# Altium schematic sheet Mechanical.SchDoc: Mechanical
size A4; Organization: ORGANIZATION; Address1: ADDRESS 1; Address2: ADDRESS 2; Address3: ADDRESS 3; Address4: ADDRESS 4; Revision: -; SheetNumber: 11; SheetTotal: 11; ENG_APP_DATE: --/--/--; DSN_APP_DATE: --/--/--; CHK_APP_DATE: --/--/--
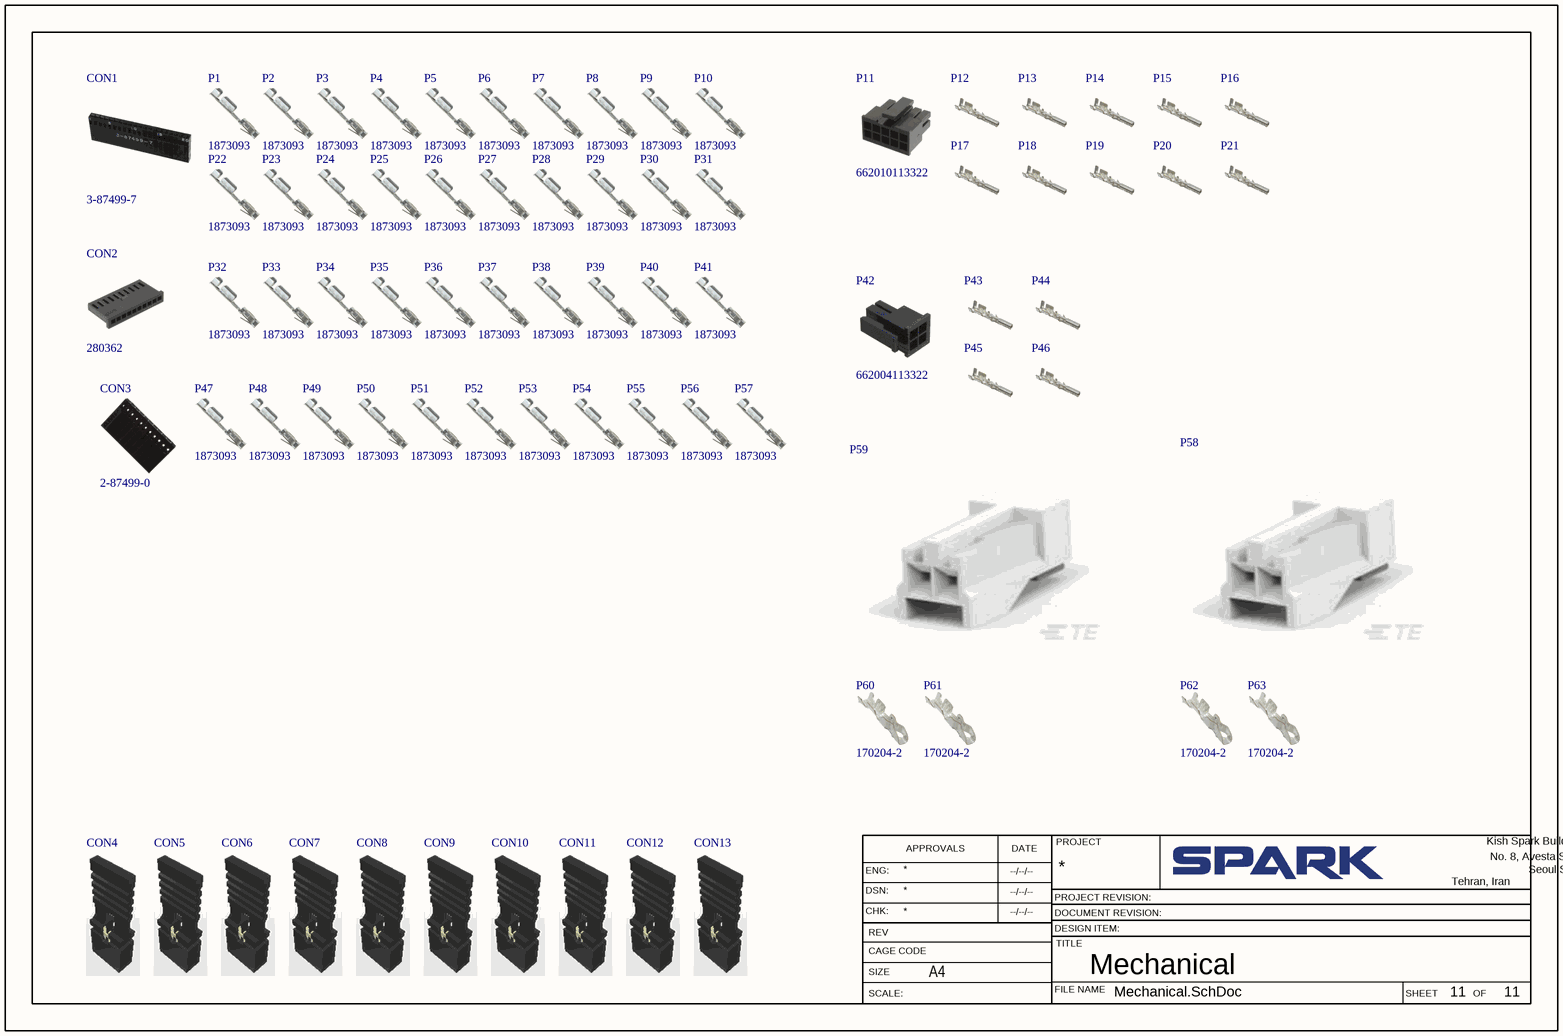
[diagram p0: Mechanical.SchDoc]

## Parts
CON1  3-87499-7  (mechanical)
CON2  280362  (mechanical)
CON3  2-87499-0  (mechanical)
CON4  609002115121  [609002115121-Footprint-1]  (value not drawn)  (mechanical)
CON5  609002115121  [609002115121-Footprint-1]  (value not drawn)  (mechanical)
CON6  609002115121  [609002115121-Footprint-1]  (value not drawn)  (mechanical)
CON7  609002115121  [609002115121-Footprint-1]  (value not drawn)  (mechanical)
CON8  609002115121  [609002115121-Footprint-1]  (value not drawn)  (mechanical)
CON9  609002115121  [609002115121-Footprint-1]  (value not drawn)  (mechanical)
CON10  609002115121  [609002115121-Footprint-1]  (value not drawn)  (mechanical)
CON11  609002115121  [609002115121-Footprint-1]  (value not drawn)  (mechanical)
CON12  609002115121  [609002115121-Footprint-1]  (value not drawn)  (mechanical)
CON13  609002115121  [609002115121-Footprint-1]  (value not drawn)  (mechanical)
P1  1873093  (mechanical)
P2  1873093  (mechanical)
P3  1873093  (mechanical)
P4  1873093  (mechanical)
P5  1873093  (mechanical)
P6  1873093  (mechanical)
P7  1873093  (mechanical)
P8  1873093  (mechanical)
P9  1873093  (mechanical)
P10  1873093  (mechanical)
P11  662010113322  [662010113322-Footprint-1]  (mechanical)
P12  66200113722DEC  (value not drawn)  (mechanical)
P13  66200113722DEC  (value not drawn)  (mechanical)
P14  66200113722DEC  (value not drawn)  (mechanical)
P15  66200113722DEC  (value not drawn)  (mechanical)
P16  66200113722DEC  (value not drawn)  (mechanical)
P17  66200113722DEC  (value not drawn)  (mechanical)
P18  66200113722DEC  (value not drawn)  (mechanical)
P19  66200113722DEC  (value not drawn)  (mechanical)
P20  66200113722DEC  (value not drawn)  (mechanical)
P21  66200113722DEC  (value not drawn)  (mechanical)
P22  1873093  (mechanical)
P23  1873093  (mechanical)
P24  1873093  (mechanical)
P25  1873093  (mechanical)
P26  1873093  (mechanical)
P27  1873093  (mechanical)
P28  1873093  (mechanical)
P29  1873093  (mechanical)
P30  1873093  (mechanical)
P31  1873093  (mechanical)
P32  1873093  (mechanical)
P33  1873093  (mechanical)
P34  1873093  (mechanical)
P35  1873093  (mechanical)
P36  1873093  (mechanical)
P37  1873093  (mechanical)
P38  1873093  (mechanical)
P39  1873093  (mechanical)
P40  1873093  (mechanical)
P41  1873093  (mechanical)
P42  662004113322  [662004113322-Footprint-1]  (mechanical)
P43  66200113722DEC  (value not drawn)  (mechanical)
P44  66200113722DEC  (value not drawn)  (mechanical)
P45  66200113722DEC  (value not drawn)  (mechanical)
P46  66200113722DEC  (value not drawn)  (mechanical)
P47  1873093  (mechanical)
P48  1873093  (mechanical)
P49  1873093  (mechanical)
P50  1873093  (mechanical)
P51  1873093  (mechanical)
P52  1873093  (mechanical)
P53  1873093  (mechanical)
P54  1873093  (mechanical)
P55  1873093  (mechanical)
P56  1873093  (mechanical)
P57  1873093  (mechanical)
P58  CMP-002-00163-4  (value not drawn)  (mechanical)
P59  CMP-002-00163-4  (value not drawn)  (mechanical)
P60  170204-2  (mechanical)
P61  170204-2  (mechanical)
P62  170204-2  (mechanical)
P63  170204-2  (mechanical)

## Notes on the sheet
- APPROVALS
- DATE
- PROJECT
- Kish Spark Building
- No. 8, Avesta Street
- ENG:
- DSN:
- CHK:
- PROJECT REVISION:
- DESIGN ITEM:
- DOCUMENT REVISION:
- Tehran, Iran
- Seoul Street, Sheikh Bahaie
- SIZE
- REV
- SCALE:
- CAGE CODE
- A4
- FILE NAME
- TITLE
- SHEET
- OF

## Library data of the parts
CON1 = CMP-00028-00014-2: Housing, Crimp / Snap, Single Row, 20 250 VAC, 3 A 750 V, AMPMODU Mod IV Series; Approvals: CSA; Connector Type: Receptacle,Socket; Contact Current Rating: 3A; Gender: Receptacle; Insulation Resistance: 5GR; Mating Alignment: No (Without); Max Voltage Rating (AC): 250V; Number of Contacts: 20; Pitch: 2.54mm; Row Spacing: 0.1inch; Max Operating Temperature: 105°C; Min Operating Temperature: -65°C; Mounting Technology: Free Hanging,Cable; Pins: 20; Color: Black; Contact Material: Copper; Contact Type: Male or Female; Current Rating: 3A; Depth: 15.24mm; ELV: Compliant; Flammability Rating: UL94 V-0; Height: 0.14inch; Housing Color: Black; Housing Material: Thermoplastic; Lead Free: Lead Free; Length: 2.01inch; Mating Connector Lock: No (Without); Number of Positions: 20; Number of Rows: 1; Orientation: Straight; Package Quantity: 200; Packaging: Bag; Reach SVHC Compliant: Unknown; Series: AMPMODU MOD IV; Strain Relief: No (Without); Termination: Crimp; Voltage Rating (AC): 250V; Width: 15.24mm
CON2 = CMP-00028-00015-2: Headers & Wire Housings 10 POS RECPT; Manufacturer: TE Connectivity; Pins: 10; Manufacturer Part Number: 280362
CON3 = CMP-00028-00016-2: Conn Housing RCP 11 POS 2.54mm Crimp ST Cable Mount Package; Approvals: CSA; Connector Type: Receptacle,Socket; Contact Current Rating: 3A; Insulation Resistance: 5GR; Mating Alignment: No (Without); Max Voltage Rating (AC): 250V; Number of Contacts: 11; Row Spacing: 0.1inch; Max Operating Temperature: 105°C; Min Operating Temperature: -65°C; Mounting Technology: Free Hanging; Color: Black; Contact Gender: Female; Contact Material: Copper; Contact Type: Female Socket; Current Rating: 3A; Depth: 15.24mm; ELV: Compliant; Flammability Rating: UL94 V-0; Height: 3.56mm; Housing Color: Black; Housing Material: Thermoplastic; Lead Free: Not Applicable; Length: 1.11inch; Mating Connector Lock: No (Without); Number of Positions: 11; Number of Rows: 1; Orientation: Straight; Package Quantity: 1; Packaging: Bulk; Pitch: 2.54mm; Radiation Hardening: No; Series: AMPMODU MOD IV; Strain Relief: No (Without); Termination: Crimp; Voltage Rating (AC): 250V
CON4-CON13 = CMP-00028-00009-4: Insulated WR-PHD Jumper with Testpoint, 3A, 1 x 2, 2.54mm Pitch; Pins: 2
P1-P10 P22-P41 P47-P57 = CMP-00028-00010-3: CONN SOCKET 20-24AWG TIN CRIMP; Approvals: CSA; Contact Current Rating: 3A; Contact Resistance: 12mR; Gender: Female; Insulation Diameter: 1.75mm; Insulation Resistance: 5GR; Shielding: Unshielded; Voltage Rating (AC): 250V; Wire Gauge (Max): 20AWG; Wire Gauge (Min): 24AWG; Wire/Cable Type: Discrete; Max Operating Temperature: 105°C; Min Operating Temperature: -65°C; Mounting Technology: Cable; Connector Type: Socket; Contact Gender: Female; Contact Material: Bronze; Contact Plating: Tin; Contact Type: Signal; Current Rating: 3A; Depth: 2.41mm; ELV: Compliant; Height: 2.03mm; Lead Free: Lead Free; Length: 12.24mm; Orientation: Straight; Package Quantity: 1000; Packaging: Loose Piece; Reach SVHC Compliant: No; Series: AMPMODU Mod V; Termination: Crimp; Wire/Cable Gauge: 24AWG
P11 = CMP-00028-00011-2: WR-MPC3 Series 3mm Pitch 10 Way 2 Row Female Straight PCB Connector Housing 6620; Connector Type: Receptacle; Current Rating: 5A; Insulation: Insulated; Insulation Resistance: 1GR; Number of Contacts: 10; Voltage Rating: 250V; Max Operating Temperature: 105°C; Min Operating Temperature: -25°C; Mounting Technology: Free Hanging; RoHS Compliant: Yes; Color: Black; Contact Gender: Female; Contact Type: Female Socket; Fastening Type: Latch; Flammability Rating: UL94 V-0; Gender: Receptacle; Height: 14mm; Housing Material: Nylon; Length: 15.85mm; Number of Positions: 10; Number of Rows: 2; Packaging: Tray; Pitch: 3mm; Reach SVHC Compliant: Unknown; Series: WR-MPC3; Termination: Crimp; Width: 15.85mm
P12-P21 P43-P46 = CMP-00028-00013-1: WR-MPC3 Series Female Tin Plated CopperAlloy DIN Connector Contact; Contact Design: STAMPED; Current Rating: 5A; Pitch: 3mm; Wire Gauge (Max): 24AWG; Wire Gauge (Min): 20AWG; Pins: 1; Contact Gender: Female; Contact Material: Copper,Tin; Contact Plating: Tin; Height: 2.4mm; Length: 2.6mm; Reach SVHC Compliant: Unknown; Series: WR-MPC3; Termination: Crimp; Width: 15.3mm
P42 = CMP-00028-00012-2: WR-MPC3 Series 3mm Pitch 4 Way 2 Row Female Straight PCB Connector Housing 6620; Connector Type: Receptacle; Current Rating: 5A; Insulation Resistance: 1GR; Number of Contacts: 4; Voltage Rating: 250V; Max Operating Temperature: 105°C; Min Operating Temperature: -25°C; Mounting Technology: Free Hanging; RoHS Compliant: Yes; Color: Black; Contact Type: Female Socket; Fastening Type: Latch; Flammability Rating: UL94 V-0; Gender: Receptacle; Height: 14mm; Housing Material: Nylon; Length: 10.6mm; Number of Positions: 4; Number of Rows: 2; Packaging: Bulk; Pitch: 3mm; Reach SVHC Compliant: Unknown; Row Spacing: 3mm; Series: WR-MPC3; Termination: Crimp; Width: 6.85mm
P58 P59 = CMP-002-00163-4: 2 Position 2.5 mm Crimp Terminal Receptacle Housing Connector; Manufacturer: TE Connectivity; Connector Type: Receptacle,Socket; PCB Mount Retention: Without; Contact Current Rating: 2A; Insulation Resistance: 500MR; Number of Positions: 2; Mating Alignment: Yes (With); Strain Relief: No (Without); Pitch: 2.5mm; Approvals: UL; Manufacturer Part Number: 171822-2; RoHS: Yes; Category: Connectors; Stock 1: 25549; Pricing 1: 1=0.24000, 10=0.16100, 50=0.16100, 100=0.13500, 1000=0.11000, 10000=0.10800 (USD); Mount: Free Hanging,Cable; Housing Color: Natural; Housing Material: Nylon; Color: Natural; Insulation Material: Polyamide; Material: Nylon; Min Operating Temperature: -20°C; Max Operating Temperature: 95°C; Series: EI; Packaging: Bag; Termination: Crimp; Orientation: Straight; Contact Type: Female Socket; Number of Rows: 1; Gender: Receptacle; Contact Gender: Female; Number of Contacts: 2; Mating Retention: Yes (With); Mating Connector Lock: Yes (With); Length: 14mm; Width: 14mm; Height: 5.75mm; Depth: 14mm; RoHS Compliant: Yes; ELV: Compliant; Lead Free: Lead Free; Flammability Rating: UL94 V-0; Reach SVHC Compliant: Yes; ComponentLink1URL: https://datasheet.ciiva.com/5795/1504042-5795504.pdf?src-supplier=Farnell; ComponentLink1Description: https://datasheet.ciiva.com/5795/1504042-5795504.pdf?src-supplier=Farnell; ComponentLink2URL: https://datasheet.ciiva.com/15178/getdatasheetpartid-138116-15178665.pdf?src-supplier=Verical; ComponentLink2Description: https://datasheet.ciiva.com/15178/getdatasheetpartid-138116-15178665.pdf?src-supplier=Verical; ComponentLink3URL: https://datasheet.ciiva.com/16321/tyco20171822-2-16321341.pdf?src-supplier=Future+Electronics; ComponentLink3Description: https://datasheet.ciiva.com/16321/tyco20171822-2-16321341.pdf?src-supplier=Future+Electronics; ComponentLink4URL: https://datasheet.ciiva.com/23813/573455-23813958.pdf?src-supplier=Newark; ComponentLink4Description: https://datasheet.ciiva.com/23813/573455-23813958.pdf?src-supplier=Newark; ComponentLink5URL: https://datasheet.ciiva.com/11740/0900766b80d9a1b1-11740548.pdf?src-supplier=Rs; ComponentLink5Description: https://datasheet.ciiva.com/11740/0900766b80d9a1b1-11740548.pdf?src-supplier=Rs; ComponentLink6URL: https://datasheet.ciiva.com/762/eng-cd-171822-l2-762908.pdf?src-supplier=Digi-Key; ComponentLink6Description: https://datasheet.ciiva.com/762/eng-cd-171822-l2-762908.pdf?src-supplier=Digi-Key; ComponentLink7URL: https://datasheet.ciiva.com/30108/pgurl-0-171822-2-0-30108319.pdf?src-supplier=Onlinecomponents.com; ComponentLink7Description: https://datasheet.ciiva.com/30108/pgurl-0-171822-2-0-30108319.pdf?src-supplier=Onlinecomponents.com; Case/Package: 1000; Pins: 0; Design Item ID: 171822-2; Component Type: Mechanical; Current Rating: 2A; Source: PTZ.SCHLIB
P60-P63 = CMP-002-00176-3: 170204-2 TE Connectivity Connector Contacts SKT Crimp ST Cable Mount 20-26AWG Loose - Arrow.com; Connector Type: Socket; Gender: Female; Insulation Resistance: 500MR; PCB Mount Retention: Without; Contact Current Rating: 2A; Number of Contacts: 6; Shielding: Unshielded; Voltage Rating (AC): 600V; Wire/Cable Gauge: 26AWG; Wire Gauge (Min): 20AWG; Pitch: 2.54mm; Insulation Diameter: 1.91mm; Plating Thickness: 0.8um; Voltage Rating: 250V; Manufacturer: TE Connectivity; Manufacturer Part Number: 170204-2; RoHS: Yes; Category: Connectors; Stock 1: 90196; Pricing 1: 1=0.12, 10=0.088, 50=0.088, 100=0.074, 1000=0.065, 10000=0.065 (USD); Mount: Cable,Through Hole; Contact Material: Bronze; Contact Plating: Tin; Housing Color: White; Housing Material: Nylon; Min Operating Temperature: -20°C; Max Operating Temperature: 105°C; Series: EI; Packaging: Loose Piece; Termination: Crimp; Contact Gender: Female; Orientation: Straight; Contact Type: Signal; Number of Rows: 1; Length: 11.1mm; Height: 10.79mm; Wire Gauge (Max): 26AWG; Depth: 2.36mm; RoHS Compliant: Yes; Reach SVHC Compliant: No; Lead Free: Lead Free; ELV: Compliant; ComponentLink1URL: https://datasheet.ciiva.com/16313/170204-2-16313345.pdf?src-supplier=Future+Electronics; ComponentLink1Description: https://datasheet.ciiva.com/16313/170204-2-16313345.pdf?src-supplier=Future+Electronics; ComponentLink2URL: https://datasheet.ciiva.com/19462/1962957-19462033.pdf?src-supplier=Jameco; ComponentLink2Description: https://datasheet.ciiva.com/19462/1962957-19462033.pdf?src-supplier=Jameco; ComponentLink3URL: https://datasheet.ciiva.com/22685/1688153-22685777.pdf?src-supplier=Element14; ComponentLink3Description: https://datasheet.ciiva.com/22685/1688153-22685777.pdf?src-supplier=Element14; ComponentLink4URL: https://datasheet.ciiva.com/18487/jpn-ss-114-5035-h-18487847.pdf?src-supplier=Digi-Key; ComponentLink4Description: https://datasheet.ciiva.com/18487/jpn-ss-114-5035-h-18487847.pdf?src-supplier=Digi-Key; ComponentLink5URL: https://datasheet.ciiva.com/15175/getdatasheetpartid-32247-15175269.pdf?src-supplier=Verical; ComponentLink5Description: https://datasheet.ciiva.com/15175/getdatasheetpartid-32247-15175269.pdf?src-supplier=Verical; ComponentLink6URL: https://datasheet.ciiva.com/11723/0900766b80d9a1b2-11723424.pdf?src-supplier=Rs; ComponentLink6Description: https://datasheet.ciiva.com/11723/0900766b80d9a1b2-11723424.pdf?src-supplier=Rs; ComponentLink7URL: https://datasheet.ciiva.com/30100/basics0-171822-2-0-30100471.pdf?src-supplier=Onlinecomponents.com; ComponentLink7Description: https://datasheet.ciiva.com/30100/basics0-171822-2-0-30100471.pdf?src-supplier=Onlinecomponents.com; ComponentLink8URL: https://datasheet.ciiva.com/16934/70085978-16934021.pdf?src-supplier=Allied+Electronics; ComponentLink8Description: https://datasheet.ciiva.com/16934/70085978-16934021.pdf?src-supplier=Allied+Electronics; ComponentLink9URL: https://datasheet.ciiva.com/696/jpn-ss-114-5035-h-696652.pdf?src-supplier=Digi-Key; ComponentLink9Description: https://datasheet.ciiva.com/696/jpn-ss-114-5035-h-696652.pdf?src-supplier=Digi-Key; Case/Package: 1000; Pins: 0; Design Item ID: 170204-2; Component Type: Mechanical; Source: V4-TEL.SCHLIB; Mounting Technology: Cable,Through Hole; Max Voltage Rating (AC): 250V; Package Quantity: 1000